# Altium schematic sheet MCU.SchDoc
size Tabloid; CompanyName: Ploopy Corporation; Organization: Ploopy Corporation; Address1: 137-1140 Burnhamthorpe Road W; Address2: Mississauga; Address3: Ontario; Address4: Canada L5C 0A3; DocumentNumber: 5; Revision: R1.003; SheetNumber: 5; SheetTotal: 9
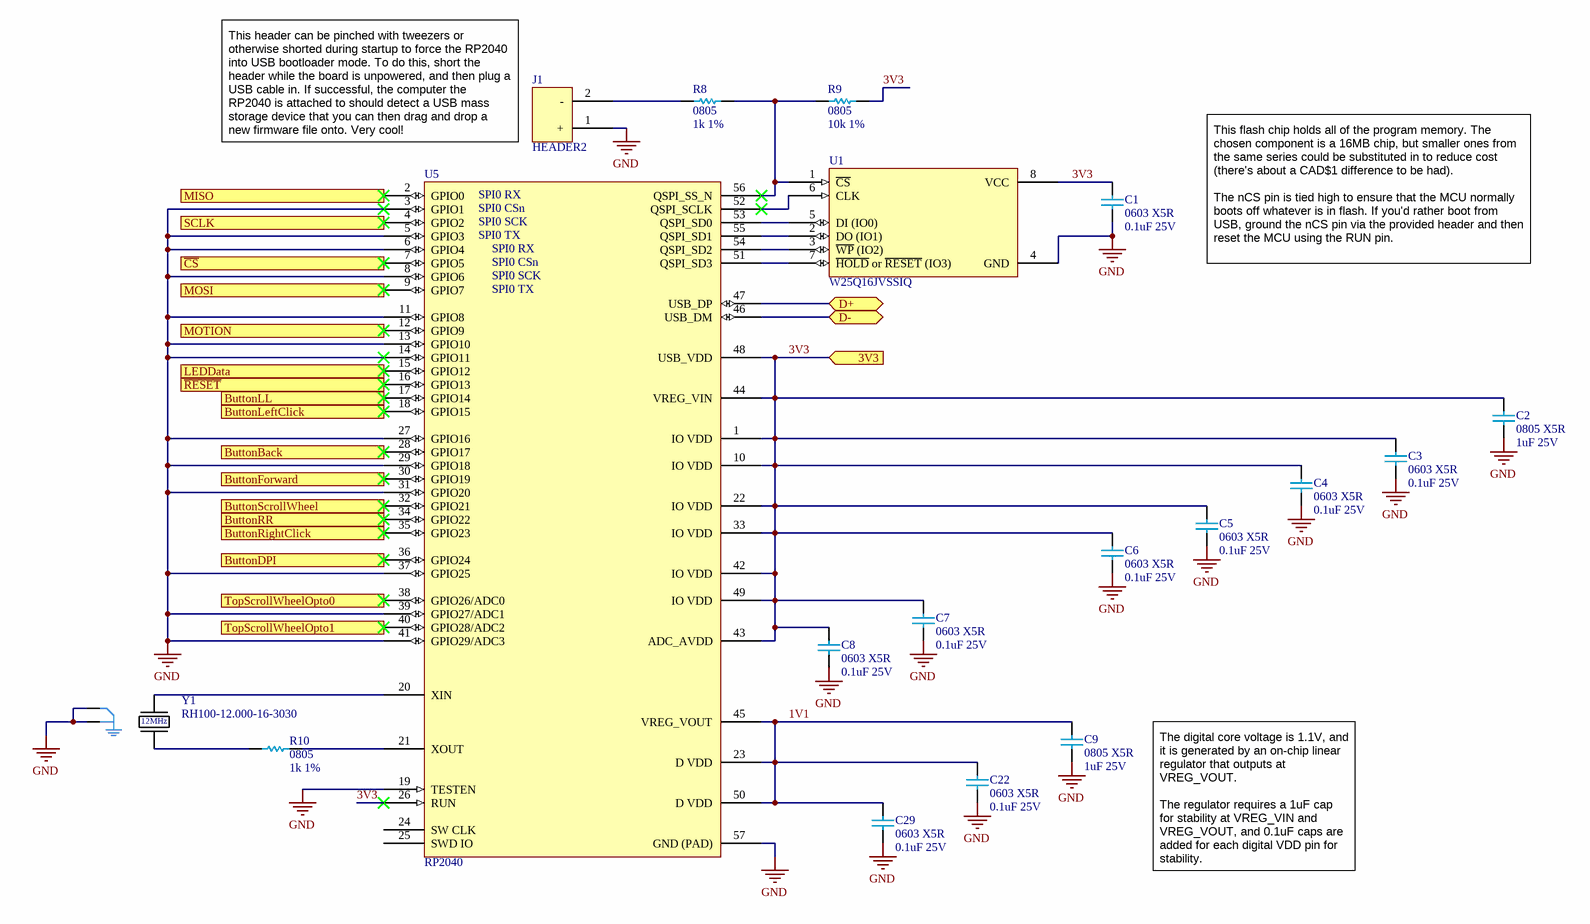
[diagram p0: MCU.SchDoc]

## Parts
C1  0603 X5R  value 0.1uF 25V  [0603 capacitor - CAPC1608X06N]
C2  0805 X5R  value 1uF 25V  [0805 - TALL]
C3  0603 X5R  value 0.1uF 25V  [0603 capacitor - CAPC1608X06N]
C4  0603 X5R  value 0.1uF 25V  [0603 capacitor - CAPC1608X06N]
C5  0603 X5R  value 0.1uF 25V  [0603 capacitor - CAPC1608X06N]
C6  0603 X5R  value 0.1uF 25V  [0603 capacitor - CAPC1608X06N]
C7  0603 X5R  value 0.1uF 25V  [0603 capacitor - CAPC1608X06N]
C8  0603 X5R  value 0.1uF 25V  [0603 capacitor - CAPC1608X06N]
C9  0805 X5R  value 1uF 25V  [0805 - TALL]
C22  0603 X5R  value 0.1uF 25V  [0603 capacitor - CAPC1608X06N]
C29  0603 X5R  value 0.1uF 25V  [0603 capacitor - CAPC1608X06N]
J1  HEADER2  [2x1]
R8  0805  value 1k 1%  [0805]
R9  0805  value 10k 1%  [0805]
R10  0805  value 1k 1%  [0805]
U1  W25Q16JVSSIQ  [W25Q128JVS - SOIC127P790X216-8M]
U5  RP2040  [RP2040 - QFN40P700X700X90_HS-57M]
Y1  RH100-12.000-16-3030  [RH100-12.000-16-3030]

## Ports
3V3 (in), ButtonBack (in), ButtonDPI (in), ButtonForward (in), ButtonLeftClick (in), ButtonLL (in), ButtonRightClick (in), ButtonRR (in), ButtonScrollWheel (in), D+ (bidir), D- (bidir), LEDData (out), MISO (in), MOSI (out), MOTION (in), SCLK (out), TopScrollWheelOpto0 (in), TopScrollWheelOpto1 (in), ~{CS} (out), ~{RESET} (out)

## Nets
GND: C1.1 C2.1 C3.1 C4.1 C5.1 C6.1 C7.1 C8.1 C9.1 C22.1 C29.1 J1.1(+) U1.4(GND) U5.3(GPIO1) U5.5(GPIO3) U5.6(GPIO4) U5.8(GPIO6) U5.11(GPIO8) U5.13(GPIO10) U5.14(GPIO11) U5.19(TESTEN) U5.27(GPIO16) U5.29(GPIO18) U5.31(GPIO20) U5.37(GPIO25) U5.39(GPIO27/ADC1) U5.41(GPIO29/ADC3) U5.57(GND_(PAD)) Y1.2 Y1.4
1V1: C9.2 C22.2 C29.2 U5.23(D_VDD) U5.45(VREG_VOUT) U5.50(D_VDD)
3V3: C1.2 C2.2 C3.2 C4.2 C5.2 C6.2 C7.2 C8.2 R9.1 U1.8(VCC) U5.1(IO_VDD) U5.10(IO_VDD) U5.22(IO_VDD) U5.26(RUN) U5.33(IO_VDD) U5.42(IO_VDD) U5.43(ADC_AVDD) U5.44(VREG_VIN) U5.48(USB_VDD) U5.49(IO_VDD) ; port 3V3
ButtonBack: U5.28(GPIO17) ; port ButtonBack
ButtonDPI: U5.36(GPIO24) ; port ButtonDPI
ButtonForward: U5.30(GPIO19) ; port ButtonForward
ButtonLeftClick: U5.18(GPIO15) ; port ButtonLeftClick
ButtonLL: U5.17(GPIO14) ; port ButtonLL
ButtonRightClick: U5.35(GPIO23) ; port ButtonRightClick
ButtonRR: U5.34(GPIO22) ; port ButtonRR
ButtonScrollWheel: U5.32(GPIO21) ; port ButtonScrollWheel
~{CS}: U5.7(GPIO5) ; port ~{CS}
D+: U5.47(USB_DP) ; port D+
D-: U5.46(USB_DM) ; port D-
LEDData: U5.15(GPIO12) ; port LEDData
MISO: U5.2(GPIO0) ; port MISO
MOSI: U5.9(GPIO7) ; port MOSI
MOTION: U5.12(GPIO9) ; port MOTION
~{RESET}: U5.16(GPIO13) ; port ~{RESET}
SCLK: U5.4(GPIO2) ; port SCLK
TopScrollWheelOpto0: U5.38(GPIO26/ADC0) ; port TopScrollWheelOpto0
TopScrollWheelOpto1: U5.40(GPIO28/ADC2) ; port TopScrollWheelOpto1
NetJ1_2: J1.2(-) R8.1
NetR8_2: R8.2 R9.2 U1.1(~{CS}) U5.56(QSPI_SS_N)
NetR10_1: R10.1 U5.21(XOUT)
NetR10_2: R10.2 Y1.3
NetU1_2: U1.2(DO_(IO1)) U5.55(QSPI_SD1)
NetU1_3: U1.3(~{WP}_(IO2)) U5.54(QSPI_SD2)
NetU1_5: U1.5(DI_(IO0)) U5.53(QSPI_SD0)
NetU1_6: U1.6(CLK) U5.52(QSPI_SCLK)
NetU1_7: U1.7(~{HOLD}_or_~{RESET}_(IO3)) U5.51(QSPI_SD3)
NetU5_20: U5.20(XIN) Y1.1

Not connected (* = marked no-connect by the designer): U5 24(SW_CLK) 25(SWD_IO)

## Notes on the sheet
- This header can be pinched with tweezers or otherwise shorted during startup to force the RP2040 into USB bootloader mode. To do this, short the header while the board is unpowered, and then plug a USB cable in. If successful, the computer the RP2040 is attached to should detect a USB mass storage device that you can then drag and drop a new firmware file onto. Very cool!
- (near U5) SPI0 RX
- (near U5) SPI0 CSn
- (near U5) SPI0 SCK
- (near U5) SPI0 TX
- This flash chip holds all of the program memory. The chosen component is a 16MB chip, but smaller ones from the same series could be substituted in to reduce cost (there's about a CAD$1 difference to be had).
  The nCS pin is tied high to ensure that the MCU normally boots off whatever is in flash. If you'd rather boot from USB, ground the nCS pin via the provided header and then reset the MCU using the RUN pin.
- The digital core voltage is 1.1V, and it is generated by an on-chip linear regulator that outputs at VREG_VOUT.
  The regulator requires a 1uF cap for stability at VREG_VIN and VREG_VOUT, and 0.1uF caps are added for each digital VDD pin for stability.
- Copyright Ploopy Corporation 2024
- Licensed under the CERN-OHL-S v2
- http://ohwr.org/cernohl
- Title:
- PCB:
- Version:
- Ploopy Corporation
- Mississauga ON L5C 0A3
- 137-1140 Burnhamthorpe Road W
- Date:
- Time:
- Sheet
- of
- Canada
- (in symbol RH100-12.000-16-3030) 12MHz

## Library data of the parts
C1 C3-C8 C22 C29 = Cap 0.1uF 25V: 0603, X5R or better; Supplier 1: Digi-Key; Supplier Part Number 1: 1276-6840-2-ND
C2 C9 = Cap 1uF 25V: 0805, X5R or better; Supplier 1: Digi-Key; Supplier Part Number 1: 1276-1066-2-ND; Supplier 2: Digi-Key; Supplier Part Number 2: 1276-1066-1-ND
J1 = HEADER2: 2-pin 0.100" header; Supplier 1: Mouser; Supplier Part Number 1: 855-M20-9990245; Supplier 2: Digi-Key; Supplier Part Number 2: 952-2261-ND
R8 R10 = Res 1k 1% 0805: Chip resistor, 1/8W 100PPM; Supplier 1: Digi-Key; Supplier Part Number 1: RMCF0805FT1K00TR-ND
R9 = Res 10k 1% 0805: Chip resistor; Supplier 1: Digi-Key; Supplier Part Number 1: RMCF0805FT10K0TR-ND
Y1 = RH100-12.000-16-3030: 12MHz Crystal 16pF 100 Ohms 4-SMD, No Lead (3.2mm x 2.5mm); Supplier 1: Digi-Key; Supplier 2: Mouser; Supplier Part Number 1: XC2686CT-ND; Supplier Part Number 2: 520-160-12-30B-AGMT
U1 = W25Q16JVSSIQ: Supplier 1: Digi-Key; Supplier Part Number 1: W25Q16JVSSIQ-ND
U5 = RP2040: Supplier 1: Newark; Supplier Part Number 1: 49AJ8740